# Altium schematic sheet Sheet3.SchDoc
size A4
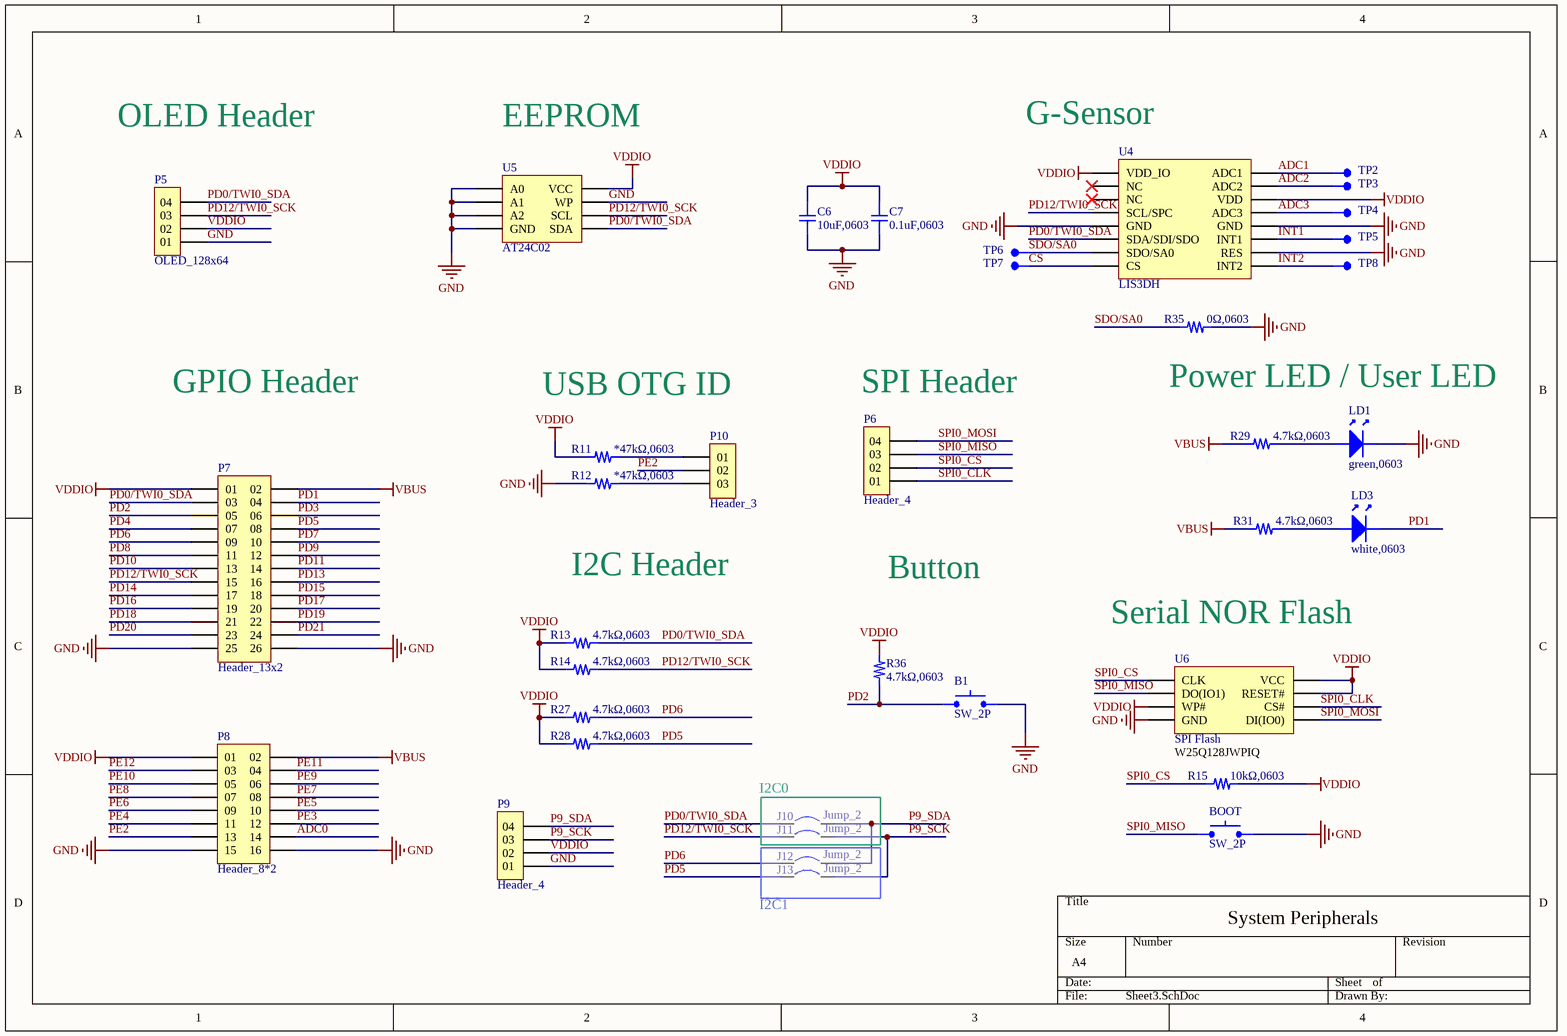
[diagram p0: Sheet3.SchDoc]

## Parts
B1  SW_2P  [SW_2P_4]
BOOT  SW_2P  [SW_2P_4]
C6  10uF,0603  [C0603]
C7  0.1uF,0603  [C0603]
J10  Jump_2  [Jp_small]
J11  Jump_2  [Jp_small]
J12  Jump_2  [Jp_small]
J13  Jump_2  [Jp_small]
LD1  green,0603  [LED0603]
LD3  white,0603  [LED0603]
P5  OLED_128x64  [Header_4]
P6  Header_4  [HEADER_4_SMD]
P7  Header_13x2  [Header_13x2]
P8  Header_8*2  [Header_8*2]
P9  Header_4  [Header_4]
P10  Header_3  [Header_3_2mm]
R11  *47kΩ,0603  [R0603]
R12  *47kΩ,0603  [R0603]
R13  4.7kΩ,0603  [R0603]
R14  4.7kΩ,0603  [R0603]
R15  10kΩ,0603  [R0603]
R27  4.7kΩ,0603  [R0603]
R28  4.7kΩ,0603  [R0603]
R29  4.7kΩ,0603  [R0603]
R31  4.7kΩ,0603  [R0603]
R35  0Ω,0603  [R0603]
R36  4.7kΩ,0603  [R0603]
TP2  TP  [TP]  (value not drawn)
TP3  TP  [TP]  (value not drawn)
TP4  TP  [TP]  (value not drawn)
TP5  TP  [TP]  (value not drawn)
TP6  TP  [TP]  (value not drawn)
TP7  TP  [TP]  (value not drawn)
TP8  TP  [TP]  (value not drawn)
U4  LIS3DH  [LGA-16]
U5  AT24C02  [SOP8]
U6  SPI Flash  [WSON8]

## Blocks framed on the sheet
I2C0: J10 J11

## Nets
GND: B1.02 BOOT.02 C6.01 C7.01 LD1.02 P5.01 P7.25 P7.26 P8.15 P8.16 P9.01 R12.01 R35.02 U4.05(GND) U4.10(RES) U4.12(GND) U5.01(A0) U5.02(A1) U5.03(A2) U5.04(GND) U5.07(WP) U6.04(GND)
VBUS: P7.02 P8.02 R29.01 R31.01
VDDIO: C6.02 C7.02 P5.02 P7.01 P8.01 P9.02 R11.01 R13.01 R14.01 R15.02 R27.01 R28.01 R36.02 U4.01(VDD_IO) U4.14(VDD) U5.08(VCC) U6.03(WP#) U6.07(RESET#) U6.08(VCC)
ADC0: P8.14
ADC1: TP2.01 U4.16(ADC1)
ADC2: TP3.01 U4.15(ADC2)
ADC3: TP4.01 U4.13(ADC3)
CS: TP7.01 U4.08(CS)
INT1: TP5.01 U4.11(INT1)
INT2: TP8.01 U4.09(INT2)
P9_SCK: J11.02 J13.02 P9.03
P9_SDA: J10.02 J12.02 P9.04
PD0/TWI0_SDA: J10.01 P5.04 P7.03 R13.02 U4.06(SDA/SDI/SDO) U5.05(SDA)
PD1: LD3.02 P7.04
PD2: B1.01 P7.05 R36.01
PD3: P7.06
PD4: P7.07
PD5: J13.01 P7.08 R28.02
PD6: J12.01 P7.09 R27.02
PD7: P7.10
PD8: P7.11
PD9: P7.12
PD10: P7.13
PD11: P7.14
PD12/TWI0_SCK: J11.01 P5.03 P7.15 R14.02 U4.04(SCL/SPC) U5.06(SCL)
PD13: P7.16
PD14: P7.17
PD15: P7.18
PD16: P7.19
PD17: P7.20
PD18: P7.21
PD19: P7.22
PD20: P7.23
PD21: P7.24
PE2: P8.13 P10.02
PE3: P8.12
PE4: P8.11
PE5: P8.10
PE6: P8.09
PE7: P8.08
PE8: P8.07
PE9: P8.06
PE10: P8.05
PE11: P8.04
PE12: P8.03
SDO/SA0: R35.01 TP6.01 U4.07(SDO/SA0)
SPI0_CLK: P6.01 U6.01(CS#)
SPI0_CS: P6.02 R15.01 U6.06(CLK)
SPI0_MISO: BOOT.01 P6.03 U6.02(DO(IO1))
SPI0_MOSI: P6.04 U6.05(DI(IO0))
NetLD1_01: LD1.01 R29.02
NetLD3_01: LD3.01 R31.02
NetP10_01: P10.01 R11.02
NetP10_03: P10.03 R12.02

Not connected (* = marked no-connect by the designer): U4 02(NC)* 03(NC)*

## Notes on the sheet
- OLED Header
- (near U5) EEPROM
- (near U4) G-Sensor
- GPIO Header
- USB OTG ID
- (near P6) SPI Header
- Power LED / User LED
- I2C Header
- Button
- Serial NOR Flash
- W25Q128JWPIQ
- I2C1
- System Peripherals

## Library data of the parts
C6 C7 = Cap
LD1 LD3 = Diode - LED
P5 = Header_4
R11-R15 R27-R29 R31 R35 R36 = Res